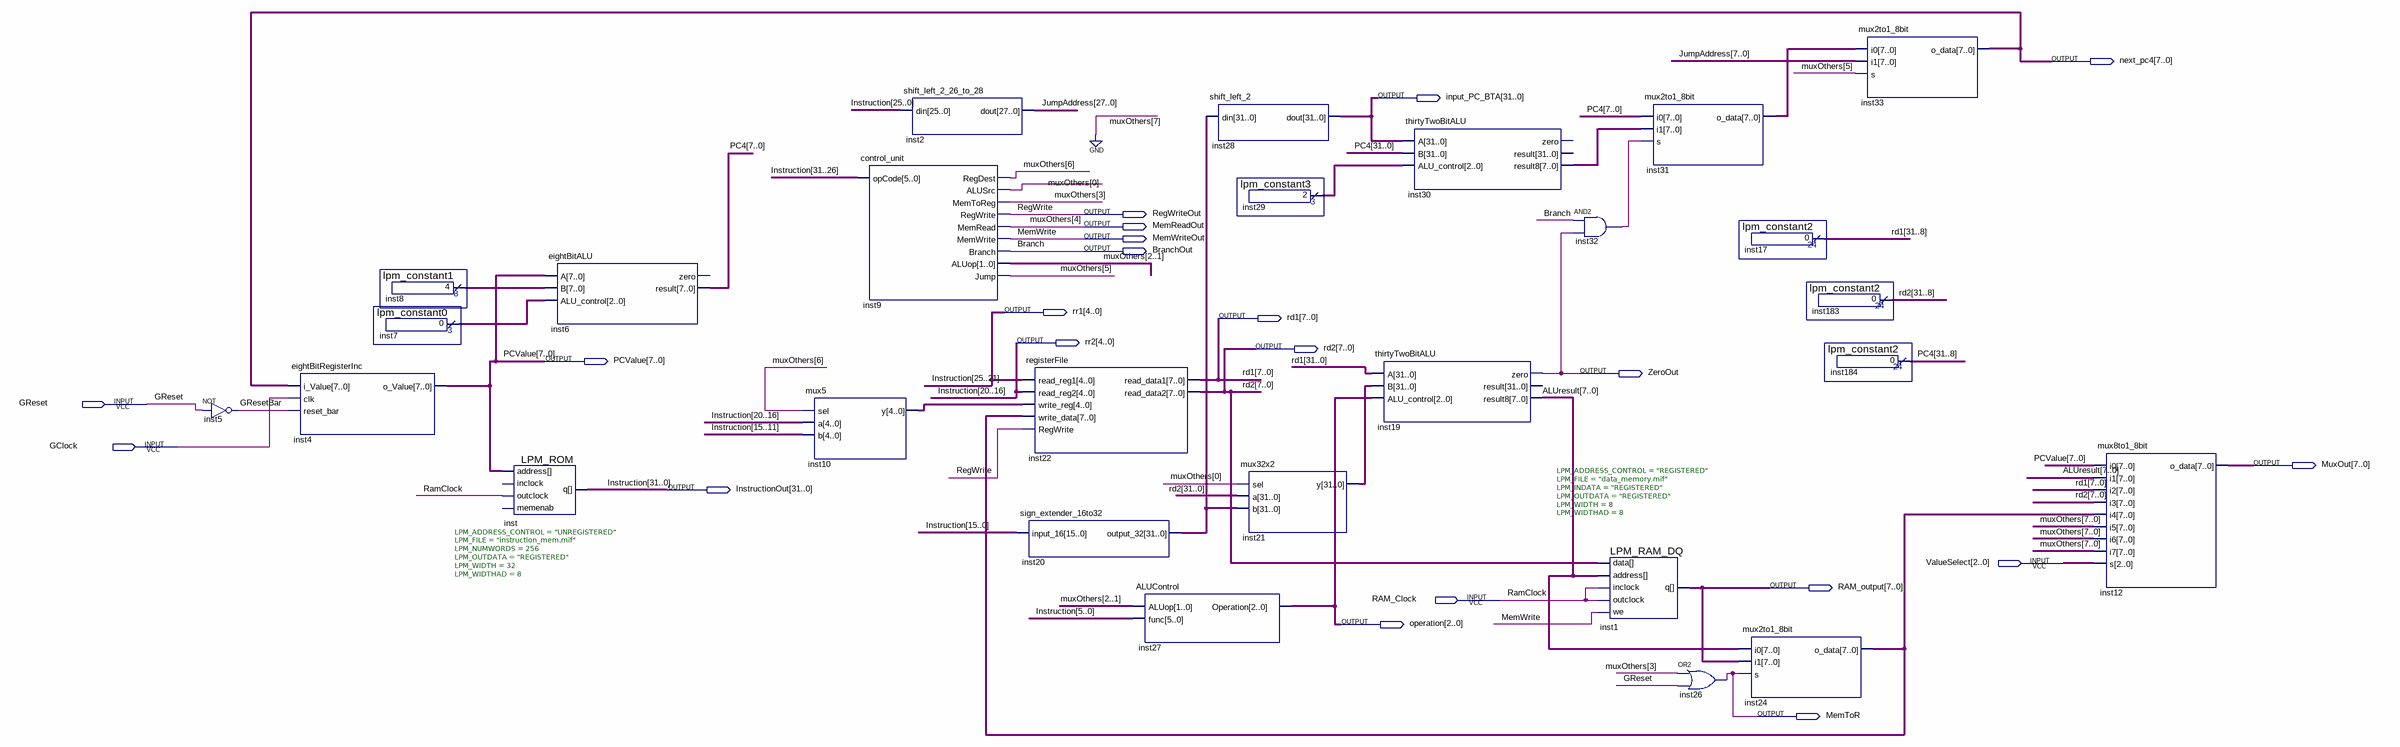
[diagram p0: schematic sheet]
// Quartus schematic Lab2.bdf as structural Verilog: 27 symbols, 21 pins
module Lab2 (
  input  GReset,
  input  GClock,
  input  [2:0] ValueSelect,
  input  RAM_Clock,
  output [7:0] next_pc4,
  output [31:0] input_PC_BTA,
  output RegWriteOut,
  output MemReadOut,
  output MemWriteOut,
  output BranchOut,
  output [4:0] rr1,
  output [31:0] rd1,
  output [4:0] rr2,
  output [31:0] rd2,
  output [7:0] PCValue,
  output ZeroOut,
  output [7:0] MuxOut,
  output [31:0] InstructionOut,
  output [7:0] RAM_output,
  output [2:0] operation,
  output MemToR
);

  wire GResetBar, inst32_out;
  wire [2:0] inst7_result, inst29_result;
  wire [4:0] inst10_y;
  wire [6:0] muxOthers;
  wire [7:0] ALUresult, inst8_result, inst24_o_data, inst30_result8, inst31_o_data;
  wire [27:0] JumpAddress;
  wire [31:0] inst20_output_32, inst21_y, PC4;

  not inst5 (GResetBar, GReset);
  eightBitRegisterInc inst4 (.i_Value(next_pc4), .clk(GClock), .reset_bar(GResetBar), .o_Value(PCValue));
  lpm_constant1 inst8 (.result(inst8_result));
  lpm_constant0 inst7 (.result(inst7_result));
  LPM_ROM #(.LPM_ADDRESS_CONTROL("UNREGISTERED"), .LPM_FILE("instruction_mem.mif"), .LPM_NUMWORDS(256), .LPM_OUTDATA("REGISTERED"), .LPM_WIDTH(32), .LPM_WIDTHAD(8)) inst (
    .address(PCValue), .outclock(RAM_Clock), .q(InstructionOut));  // open: inclock, memenab
  eightBitALU inst6 (.A(PCValue), .B(inst8_result), .ALU_control(inst7_result), .result(PC4[7:0]));  // open: zero
  mux5 inst10 (.sel(muxOthers[6]), .a(InstructionOut[20:16]), .b(InstructionOut[15:11]), .y(inst10_y));
  control_unit inst9 (
    .opCode(InstructionOut[31:26]), .RegDest(muxOthers[6]), .ALUSrc(muxOthers[0]), .MemToReg(muxOthers[3]),
    .RegWrite(RegWriteOut), .MemRead(MemReadOut), .MemWrite(MemWriteOut), .Branch(BranchOut),
    .ALUop(muxOthers[2:1]), .Jump(muxOthers[5]));
  shift_left_2_26_to_28 inst2 (.din(InstructionOut[25:0]), .dout(JumpAddress));
  registerFile inst22 (
    .read_reg1(InstructionOut[25:21]), .read_reg2(InstructionOut[20:16]), .write_reg(inst10_y),
    .write_data(inst24_o_data), .RegWrite(RegWriteOut), .read_data1(rd1[7:0]), .read_data2(rd2[7:0]));
  sign_extender_16to32 inst20 (.input_16(InstructionOut[15:0]), .output_32(inst20_output_32));
  ALUControl inst27 (.ALUop(muxOthers[2:1]), .func(InstructionOut[5:0]), .Operation(operation));
  shift_left_2 inst28 (.din(inst20_output_32), .dout(input_PC_BTA));
  lpm_constant3 inst29 (.result(inst29_result));
  mux32x2 inst21 (.sel(muxOthers[0]), .a(rd2), .b(inst20_output_32), .y(inst21_y));
  thirtyTwoBitALU inst19 (
    .A(rd1), .B(inst21_y), .ALU_control(operation), .zero(ZeroOut), .result8(ALUresult));  // open: result
  thirtyTwoBitALU inst30 (
    .A(input_PC_BTA), .B(PC4), .ALU_control(inst29_result), .result8(inst30_result8));  // open: zero, result
  and inst32 (inst32_out, BranchOut, ZeroOut);
  LPM_RAM_DQ #(.LPM_ADDRESS_CONTROL("REGISTERED"), .LPM_FILE("data_memory.mif"), .LPM_INDATA("REGISTERED"), .LPM_OUTDATA("REGISTERED"), .LPM_WIDTH(8), .LPM_WIDTHAD(8)) inst1 (
    .inclock(RAM_Clock), .data(rd2[7:0]), .address(ALUresult), .we(MemWriteOut), .outclock(RAM_Clock),
    .q(RAM_output));
  mux2to1_8bit inst31 (.i0(PC4[7:0]), .i1(inst30_result8), .s(inst32_out), .o_data(inst31_o_data));
  or inst26 (MemToR, muxOthers[3], GReset);
  lpm_constant2 inst17 (.result(rd1[31:8]));
  mux2to1_8bit inst24 (.i0(ALUresult), .i1(RAM_output), .s(MemToR), .o_data(inst24_o_data));
  lpm_constant2 inst183 (.result(rd2[31:8]));
  lpm_constant2 inst184 (.result(PC4[31:8]));
  mux2to1_8bit inst33 (.i0(inst31_o_data), .i1(JumpAddress[7:0]), .s(muxOthers[5]), .o_data(next_pc4));
  mux8to1_8bit inst12 (
    .i0(PCValue), .i1(ALUresult), .i2(rd1[7:0]), .i3(rd2[7:0]), .i4(inst24_o_data),
    .i5({1'b0, muxOthers[6:5], MemReadOut, muxOthers[3:0]}),
    .i6({1'b0, muxOthers[6:5], MemReadOut, muxOthers[3:0]}),
    .i7({1'b0, muxOthers[6:5], MemReadOut, muxOthers[3:0]}), .s(ValueSelect), .o_data(MuxOut));

  assign rr1 = InstructionOut[25:21];
  assign rr2 = InstructionOut[20:16];

  // Other names for the same wires on the sheet: Branch = BranchOut; Instruction[31:0] = InstructionOut;
  //   MemWrite = MemWriteOut; muxOthers[4] = MemReadOut; RamClock = RAM_Clock; RegWrite = RegWriteOut
endmodule
